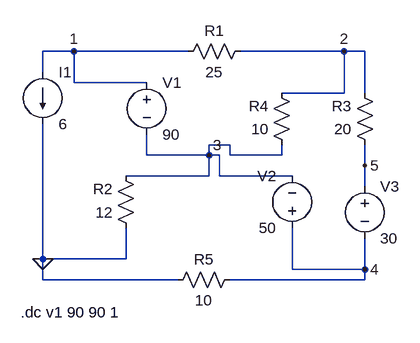
[diagram p0: schematic Draft3.asc]
Draft3.asc, the LTspice schematic file:
Version 4
SHEET 1 880 680
WIRE -96 48 -144 48
WIRE 80 48 -96 48
WIRE 320 48 160 48
WIRE 352 48 320 48
WIRE -144 80 -144 48
WIRE -96 96 -96 48
WIRE 16 96 -96 96
WIRE 320 112 320 48
WIRE 320 112 224 112
WIRE 352 112 352 48
WIRE 144 192 112 192
WIRE 16 208 16 176
WIRE 112 208 112 192
WIRE 112 208 16 208
WIRE 128 208 112 208
WIRE 144 208 144 192
WIRE 224 208 224 192
WIRE 224 208 144 208
WIRE 352 224 352 192
WIRE 112 240 112 208
WIRE 112 240 -16 240
WIRE 128 240 128 208
WIRE 240 240 128 240
WIRE 352 256 352 224
WIRE -144 368 -144 160
WIRE -16 368 -16 320
WIRE -16 368 -144 368
WIRE 240 384 240 320
WIRE 352 384 352 336
WIRE 352 384 240 384
WIRE -144 400 -144 368
WIRE 64 400 -144 400
WIRE 352 400 352 384
WIRE 352 400 144 400
FLAG -144 368 0
FLAG -96 48 1
FLAG 320 48 2
FLAG 112 208 3
FLAG 352 384 4
FLAG 352 224 5
SYMBOL res 176 32 R90
WINDOW 0 0 56 VBottom 2
WINDOW 3 32 56 VTop 2
SYMATTR InstName R1
SYMATTR Value 25
SYMBOL res 0 336 R180
WINDOW 0 36 76 Left 2
WINDOW 3 36 40 Left 2
SYMATTR InstName R2
SYMATTR Value 12
SYMBOL res 368 208 R180
WINDOW 0 36 76 Left 2
WINDOW 3 36 40 Left 2
SYMATTR InstName R3
SYMATTR Value 20
SYMBOL res 240 208 R180
WINDOW 0 36 76 Left 2
WINDOW 3 36 40 Left 2
SYMATTR InstName R4
SYMATTR Value 10
SYMBOL res 48 416 R270
WINDOW 0 32 56 VTop 2
WINDOW 3 0 56 VBottom 2
SYMATTR InstName R5
SYMATTR Value 10
SYMBOL current -144 80 R0
SYMATTR InstName I1
SYMATTR Value 6
SYMBOL voltage 16 80 R0
WINDOW 123 0 0 Left 0
WINDOW 39 0 0 Left 0
SYMATTR InstName V1
SYMATTR Value 90
SYMBOL voltage 240 336 R180
WINDOW 0 24 96 Left 2
WINDOW 3 24 16 Left 2
WINDOW 123 0 0 Left 0
WINDOW 39 0 0 Left 0
SYMATTR InstName V2
SYMATTR Value 50
SYMBOL voltage 352 240 R0
WINDOW 123 0 0 Left 0
WINDOW 39 0 0 Left 0
SYMATTR InstName V3
SYMATTR Value 30
TEXT -178 450 Left 2 !.dc v1 90 90 1

The netlist it stands for:
* Draft3.asc
R1 2 1 25
R2 0 3 12
R3 5 2 20
R4 3 2 10
R5 0 4 10
I1 1 0 6
V1 1 3 90
V2 4 3 50
V3 5 4 30
.dc v1 90 90 1
.backanno
.end